# Altium schematic sheet Master.SchDoc: QUTMS HVBoard V1.1 - Master
size A4; DocumentNumber: 1; SheetNumber: 1; SheetTotal: 8
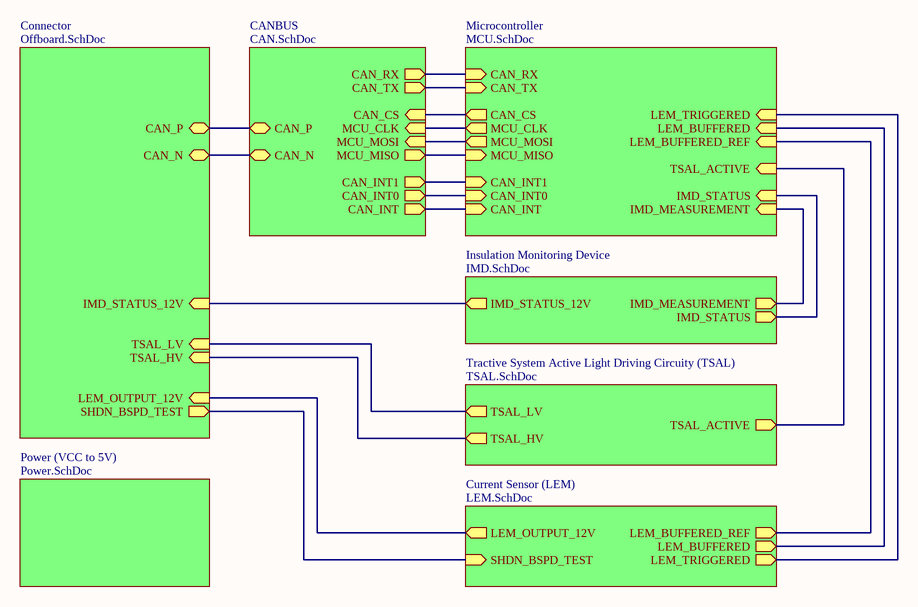
[diagram p0: Master.SchDoc]

## Sub-sheets
CANBUS = CAN.SchDoc: MCU_MOSI (in), MCU_CLK (in), CAN_CS (in), MCU_MISO (out), CAN_N (bidir), CAN_P (bidir), CAN_INT1 (out), CAN_INT0 (out), CAN_INT (out), CAN_RX (out), CAN_TX (out)
Connector = Offboard.SchDoc: SHDN_BSPD_TEST (out), TSAL_LV (in), CAN_P (bidir), TSAL_HV (in), CAN_N (bidir), LEM_OUTPUT_12V (in), IMD_STATUS_12V (in)
Current Sensor (LEM) = LEM.SchDoc: SHDN_BSPD_TEST (in), LEM_BUFFERED_REF (out), LEM_BUFFERED (out), LEM_OUTPUT_12V (out), LEM_TRIGGERED (out)
Insulation Monitoring Device = IMD.SchDoc: IMD_STATUS_12V (out), IMD_MEASUREMENT (out), IMD_STATUS (out)
Microcontroller = MCU.SchDoc: CAN_INT (in), CAN_INT0 (in), CAN_INT1 (in), MCU_MISO (in), MCU_MOSI (out), MCU_CLK (out), CAN_CS (out), LEM_BUFFERED_REF (in), LEM_BUFFERED (in), IMD_MEASUREMENT (in), IMD_STATUS (in), TSAL_ACTIVE (in), LEM_TRIGGERED (in), CAN_RX (in), CAN_TX (in)
Power (VCC to 5V) = Power.SchDoc: no entries
Tractive System Active Light Driving Circuity (TSAL) = TSAL.SchDoc: TSAL_HV (out), TSAL_LV (out), TSAL_ACTIVE (out)

## Nets
(unnamed): sheet Connector/SHDN_BSPD_TEST, sheet Current Sensor (LEM)/SHDN_BSPD_TEST
(unnamed): sheet Connector/TSAL_LV, sheet Tractive System Active Light Driving Circuity (TSAL)/TSAL_LV
(unnamed): sheet Connector/CAN_P, sheet CANBUS/CAN_P
(unnamed): sheet Connector/TSAL_HV, sheet Tractive System Active Light Driving Circuity (TSAL)/TSAL_HV
(unnamed): sheet Connector/CAN_N, sheet CANBUS/CAN_N
(unnamed): sheet Connector/LEM_OUTPUT_12V, sheet Current Sensor (LEM)/LEM_OUTPUT_12V
(unnamed): sheet Connector/IMD_STATUS_12V, sheet Insulation Monitoring Device/IMD_STATUS_12V
(unnamed): sheet Microcontroller/CAN_INT, sheet CANBUS/CAN_INT
(unnamed): sheet Microcontroller/CAN_INT0, sheet CANBUS/CAN_INT0
(unnamed): sheet Microcontroller/CAN_INT1, sheet CANBUS/CAN_INT1
(unnamed): sheet Microcontroller/MCU_MISO, sheet CANBUS/MCU_MISO
(unnamed): sheet Microcontroller/MCU_MOSI, sheet CANBUS/MCU_MOSI
(unnamed): sheet Microcontroller/MCU_CLK, sheet CANBUS/MCU_CLK
(unnamed): sheet Microcontroller/CAN_CS, sheet CANBUS/CAN_CS
(unnamed): sheet Microcontroller/LEM_BUFFERED_REF, sheet Current Sensor (LEM)/LEM_BUFFERED_REF
(unnamed): sheet Microcontroller/LEM_BUFFERED, sheet Current Sensor (LEM)/LEM_BUFFERED
(unnamed): sheet Microcontroller/IMD_MEASUREMENT, sheet Insulation Monitoring Device/IMD_MEASUREMENT
(unnamed): sheet Microcontroller/IMD_STATUS, sheet Insulation Monitoring Device/IMD_STATUS
(unnamed): sheet Microcontroller/TSAL_ACTIVE, sheet Tractive System Active Light Driving Circuity (TSAL)/TSAL_ACTIVE
(unnamed): sheet Microcontroller/LEM_TRIGGERED, sheet Current Sensor (LEM)/LEM_TRIGGERED
(unnamed): sheet Microcontroller/CAN_RX, sheet CANBUS/CAN_RX
(unnamed): sheet Microcontroller/CAN_TX, sheet CANBUS/CAN_TX

## Notes on the sheet
- Title
- Size:
- A4
- Number:
- Revision:
- QUT Motorsport, O-120
- O Block, QUT Gardens Point
- Date:
- Time:
- Sheet
- of
- Brisbane, QLD, Australia